# EAGLE design logic_gates_cmos (EAGLE 7.6.0)
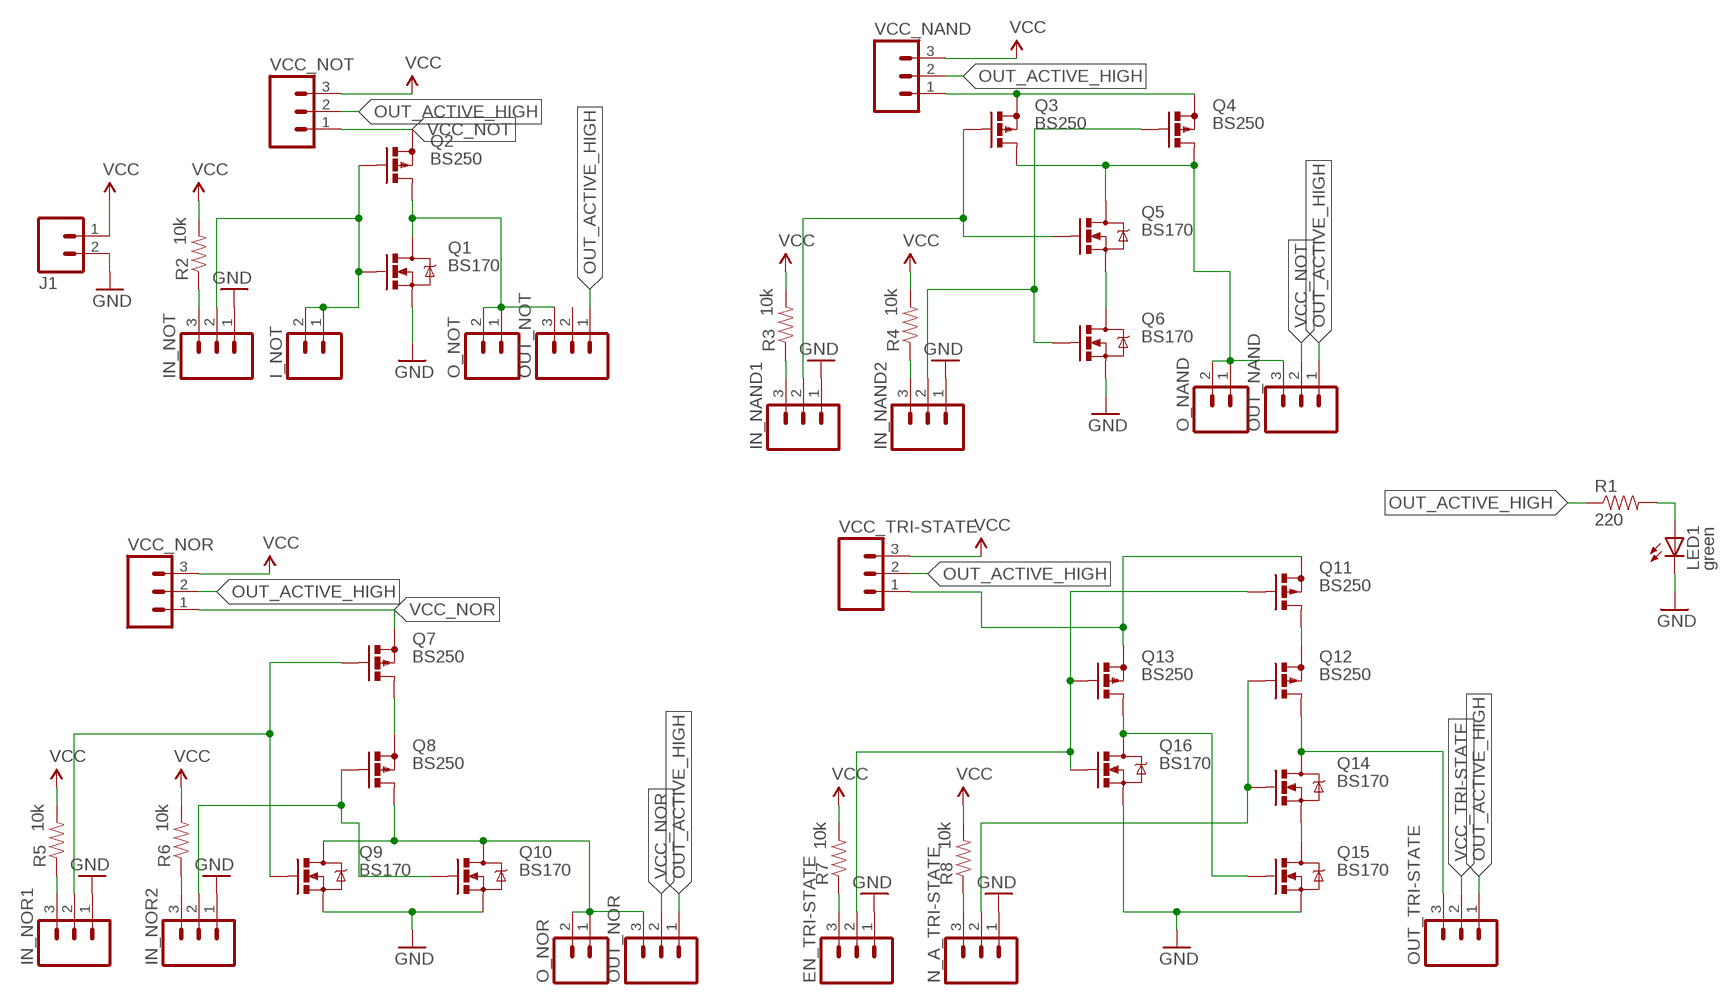
[diagram p0: schematic, sheet 1]

## Parts
EN_TRI-STATE  M03LONGPADS  [1X03_LONGPADS]
I_NOT  M02PTH  [1X02]
IN_NAND1  M03LONGPADS  [1X03_LONGPADS]
IN_NAND2  M03LONGPADS  [1X03_LONGPADS]
IN_NOR1  M03LONGPADS  [1X03_LONGPADS]
IN_NOR2  M03LONGPADS  [1X03_LONGPADS]
IN_NOT  M03LONGPADS  [1X03_LONGPADS]
J1  M02LOCK_LONGPADS  [1X02_LOCK_LONGPADS]
LED1  green  LED3MM  [LED3MM]
N_A_TRI-STATE  M03LONGPADS  [1X03_LONGPADS]
O_NAND  M02PTH  [1X02]
O_NOR  M02PTH  [1X02]
O_NOT  M02PTH  [1X02]
OUT_NAND  M03LONGPADS  [1X03_LONGPADS]
OUT_NOR  M03LONGPADS  [1X03_LONGPADS]
OUT_NOT  M03LONGPADS  [1X03_LONGPADS]
OUT_TRI-STATE  M03LONGPADS  [1X03_LONGPADS]
Q1  BS170  BS170_LP  [TO92-OVAL]
Q2  BS250  PFETBS250  [TO92-OVAL]
Q3  BS250  PFETBS250  [TO92-OVAL]
Q4  BS250  PFETBS250  [TO92-OVAL]
Q5  BS170  BS170_LP  [TO92-OVAL]
Q6  BS170  BS170_LP  [TO92-OVAL]
Q7  BS250  PFETBS250  [TO92-OVAL]
Q8  BS250  PFETBS250  [TO92-OVAL]
Q9  BS170  BS170_LP  [TO92-OVAL]
Q10  BS170  BS170_LP  [TO92-OVAL]
Q11  BS250  PFETBS250  [TO92-OVAL]
Q12  BS250  PFETBS250  [TO92-OVAL]
Q13  BS250  PFETBS250  [TO92-OVAL]
Q14  BS170  BS170_LP  [TO92-OVAL]
Q15  BS170  BS170_LP  [TO92-OVAL]
Q16  BS170  BS170_LP  [TO92-OVAL]
R1  220  RESISTORPTH-1/4W  [AXIAL-0.4]
R2  10k  RESISTORPTH-1/4W  [AXIAL-0.4]
R3  10k  RESISTORPTH-1/4W  [AXIAL-0.4]
R4  10k  RESISTORPTH-1/4W  [AXIAL-0.4]
R5  10k  RESISTORPTH-1/4W  [AXIAL-0.4]
R6  10k  RESISTORPTH-1/4W  [AXIAL-0.4]
R7  10k  RESISTORPTH-1/4W  [AXIAL-0.4]
R8  10k  RESISTORPTH-1/4W  [AXIAL-0.4]
VCC_NAND  M03LONGPADS  [1X03_LONGPADS]
VCC_NOR  M03LONGPADS  [1X03_LONGPADS]
VCC_NOT  M03LONGPADS  [1X03_LONGPADS]
VCC_TRI-STATE  M03LONGPADS  [1X03_LONGPADS]

## Nets
GND [pwr_gnd]: EN_TRI-STATE.1 IN_NAND1.1 IN_NAND2.1 IN_NOR1.1 IN_NOR2.1 IN_NOT.1 J1.2 LED1.K(C) N_A_TRI-STATE.1 Q1.3(S) Q6.3(S) Q9.3(S) Q10.3(S) Q15.3(S) Q16.3(S)
N$1: O_NAND.1 O_NAND.2 OUT_NAND.3 Q3.1(D) Q4.1(D) Q5.1(D)
N$2: IN_NOR1.2 Q7.2(G) Q9.2(G)
N$3: Q3.3(S) Q4.3(S) VCC_NAND.1
N$4: IN_NOR1.3 R5.P$1
N$5: Q5.3(S) Q6.1(D)
N$6: IN_NOR2.2 Q8.2(G) Q10.2(G)
N$7: IN_NOR2.3 R6.P$1
N$8: O_NOT.1 O_NOT.2 OUT_NOT.3 Q1.1(D) Q2.1(D)
N$9: O_NOR.1 O_NOR.2 OUT_NOR.3 Q8.1(D) Q9.1(D) Q10.1(D)
N$10: Q7.1(D) Q8.3(S)
N$11: EN_TRI-STATE.2 Q11.2(G) Q13.2(G) Q16.2(G)
N$12: EN_TRI-STATE.3 R7.P$1
N$13: LED1.A R1.P$2
N$14: I_NOT.1 I_NOT.2 IN_NOT.2 Q1.2(G) Q2.2(G)
N$15: IN_NAND2.2 Q4.2(G) Q6.2(G)
N$16: Q13.1(D) Q15.2(G) Q16.1(D)
N$19: Q11.1(D) Q12.3(S)
N$20: Q14.3(S) Q15.1(D)
N$21: IN_NOT.3 R2.P$1
N$22: IN_NAND1.2 Q3.2(G) Q5.2(G)
N$23: N_A_TRI-STATE.2 Q12.2(G) Q14.2(G)
N$24: IN_NAND1.3 R3.P$1
N$26: IN_NAND2.3 R4.P$1
N$27: N_A_TRI-STATE.3 R8.P$1
N$28: OUT_TRI-STATE.3 Q12.1(D) Q14.1(D)
OUT_ACTIVE_HIGH: OUT_NAND.1 OUT_NOR.1 OUT_NOT.1 OUT_TRI-STATE.1 R1.P$1 VCC_NAND.2 VCC_NOR.2 VCC_NOT.2 VCC_TRI-STATE.2
VCC: J1.1 R2.P$2 R3.P$2 R4.P$2 R5.P$2 R6.P$2 R7.P$2 R8.P$2 VCC_NAND.3 VCC_NOR.3 VCC_NOT.3 VCC_TRI-STATE.3
VCC_NOR: OUT_NOR.2 Q7.3(S) VCC_NOR.1
VCC_NOT: OUT_NAND.2 Q2.3(S) VCC_NOT.1
VCC_TRI-STATE: OUT_TRI-STATE.2 Q11.3(S) Q13.3(S) VCC_TRI-STATE.1
Unconnected: OUT_NOT.2

## Library data of the parts
EN_TRI-STATE IN_NAND1 IN_NAND2 IN_NOR1 IN_NOR2 IN_NOT N_A_TRI-STATE OUT_NAND OUT_NOR OUT_NOT OUT_TRI-STATE VCC_NAND VCC_NOR VCC_NOT VCC_TRI-STATE = SparkFun-Connectors:M03: Header 3 Standard 3-pin 0.1" header. Use with straight break away headers (SKU : PRT-00116), right angle break away headers (PRT-00553), swiss pins (PRT-00743), machine pins (PRT-00117), and female headers (PRT-00115). Molex polarized connector foot print use with SKU : PRT-08232 with associated crimp pins and housings.
I_NOT J1 O_NAND O_NOR O_NOT = SparkFun-Connectors:M02: Standard 2-pin 0.1" header. Use with - straight break away headers ( PRT-00116) - right angle break away headers (PRT-00553) - swiss pins (PRT-00743) - machine pins (PRT-00117) - female headers (PRT-00115) Molex polarized connector foot print use with: PRT-08233 with associated crimp pins and housings. 2.54_SCREWTERM for use with PRT-10571. 3.5mm Screw Terminal footprints for PRT-08084 5mm Screw Terminal footprints for use with PRT-08432
LED1 = adafruit:LED: LED OSRAM: - CHIPLED LG R971, LG N971, LY N971, LG Q971, LY Q971, LO R971, LY R971 LH N974, LH R974 LS Q976, LO Q976, LY Q976 LO Q996 - Hyper CHIPLED LW Q18S LB Q993, LB Q99A, LB R99A - SideLED LS A670, LO A670, LY A670, LG A670, LP A670 LB A673, LV A673, LT A673, LW A673 LH A674 LY A675 LS A676, LA A676, LO A676, LY A676, LW A676 LS A679, LY A679, LG A679 - Hyper Micro SIDELED® LS Y876, LA Y876, LO Y876, LY Y876 LT Y87S - SmartLED LW L88C, LW L88S LB L89C, LB L89S, LG L890 LS L89K, LO L89K, LY L89K LS L896, LA L896, LO L896, LY L896 - TOPLED LS T670, LO T670, LY T670, LG T670, LP T670 LSG T670, LSP T670, LSY T670, LOP T670, LYG T670 LG T671, LOG T671, LSG T671 LB T673, LV T673, LT T673, LW T673 LH T674 LS T676, LA T676, LO T676, LY T676, LB T676, LH T676, LSB T676, LW T676 LB T67C, LV T67C, LT T67C, LS T67K, LO T67K, LY T67K, LW E67C LS E67B, LA E67B, LO E67B, LY E67B, LB E67C, LV E67C, LT E67C LW T67C LS T679, LY T679, LG T679 LS T770, LO T770, LY T770, LG T770, LP T770 LB T773, LV T773, LT T773, LW T773 LH T774 LS E675, LA E675, LY E675, LS T675 LS T776, LA T776, LO T776, LY T776, LB T776 LHGB T686 LT T68C, LB T68C - Hyper Mini TOPLED® LB M676 - Mini TOPLED Santana® LG M470 LS M47K, LO M47K, LY M47K Source: http://www.osram.convergy.de/
Q1 Q5 Q6 Q9 Q10 Q14-Q16 = Useful_Parts:BS170_LP
Q2-Q4 Q7 Q8 Q11-Q13 = Useful_Parts:PFET: P-CHANNEL MOS FET
R1-R8 = SparkFun-Resistors:RESISTOR: Resistor Basic schematic elements and footprints for 0603, 1206, and PTH resistors.

## Net classes
0 default: width 0.5 mm, drill 0.8 mm, clearance 0.4 mm
1 pwr_gnd: width 0.4 mm, drill 0.8 mm, clearance 0.5 mm

## Board
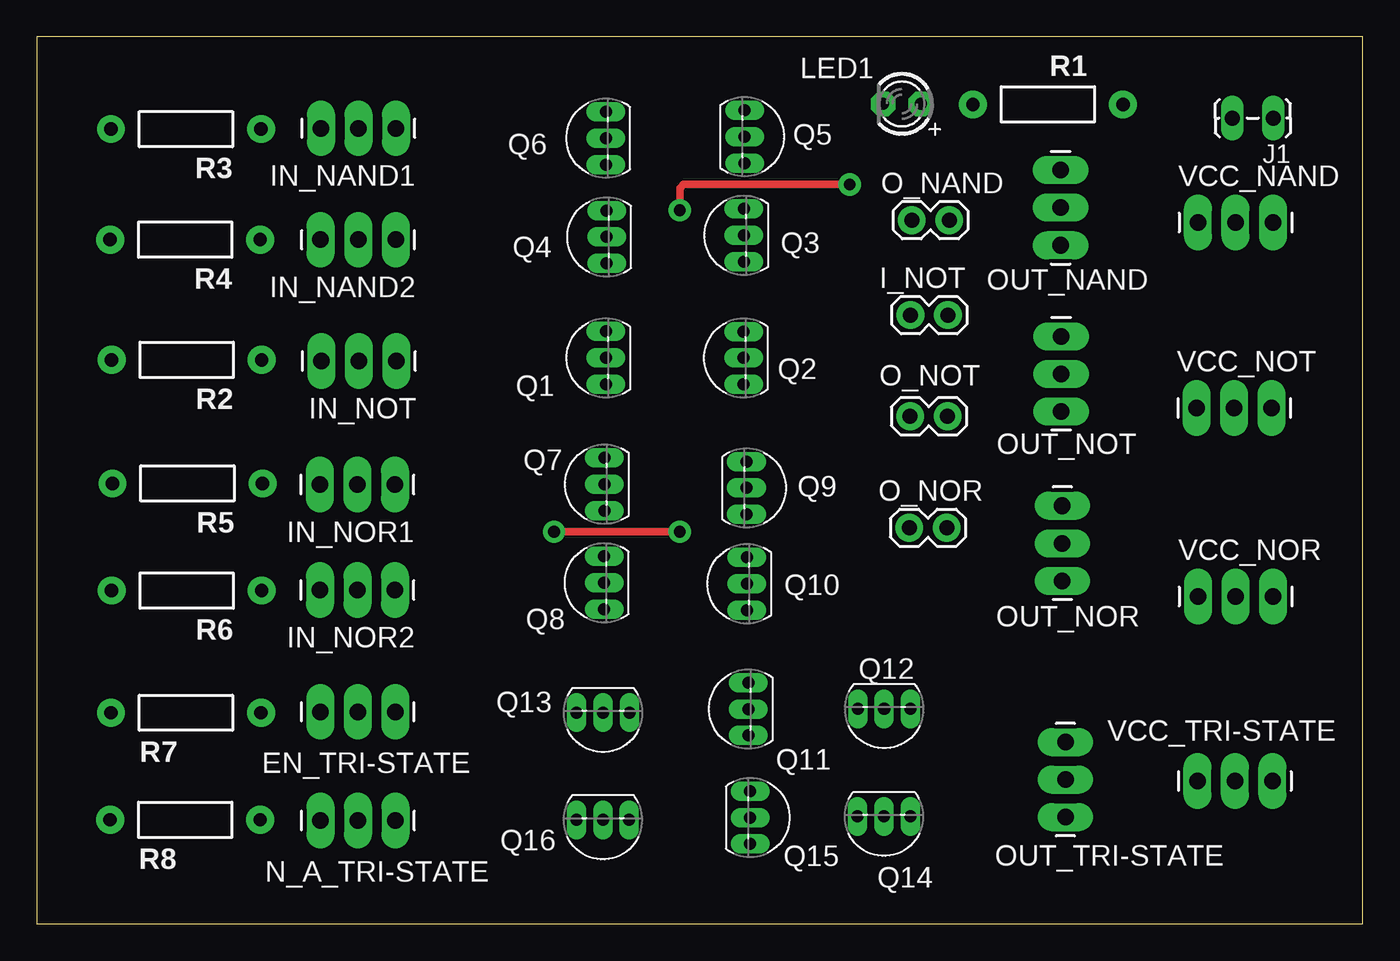
[diagram p1: board, top side]
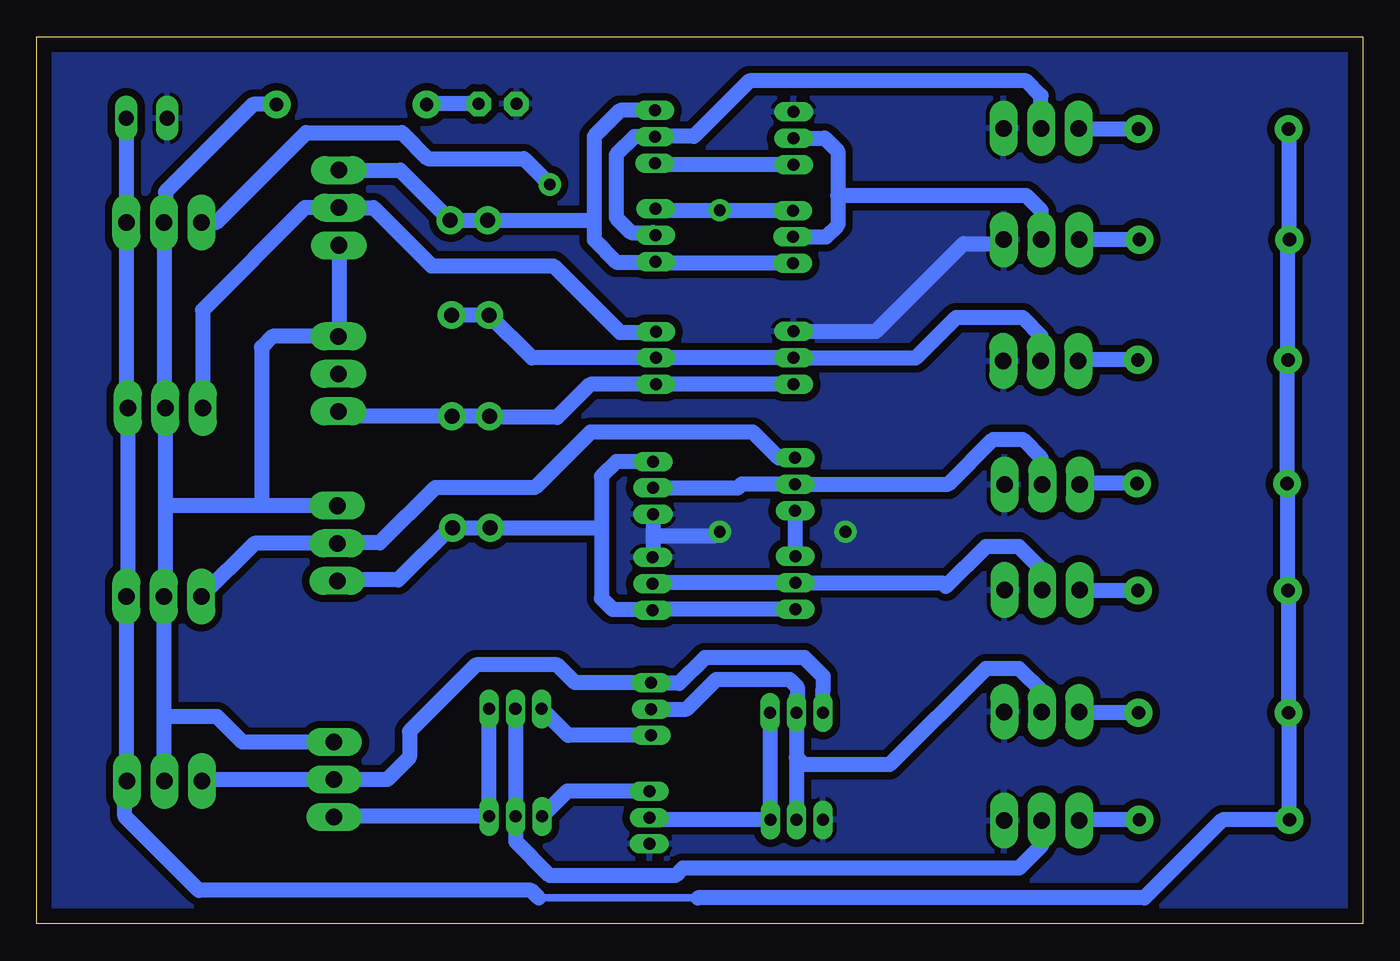
[diagram p2: board, bottom side, seen from below]

Size 89.7 x 59.98 mm. Coordinates in mm from the lower left corner, seen from the top.
Outline: 0,0 89.7,0 89.7,59.98 0,59.98 0,0
Copper layers (1*16): Top 0.035mm / dielectric 1.5mm / Bottom 0.035mm
Design rules "default": minimum track width 10mil, minimum drill 24mil, track to track 8mil, track to pad 8mil, pad to pad 8mil, via to via 8mil, smd to smd 8mil, copper to edge 40mil, drill to drill 8mil, minimum pad ring 10mil, minimum via ring 8mil, stop-mask expansion 4mil, vias tented up to drill 0mil, thermal gap 10mil

### Footprints (pad centres in the part's own frame; a part is rotated, then mirrored left to right if it is on the bottom)
1X03_LONGPADS = drill 1.118 pad 1.88 long: 1 0,0; 2 2.54,0; 3 5.08,0
1X02 = drill 1.016 pad 1.88: 1 0,0; 2 2.54,0
1X02_LOCK_LONGPADS = drill 1.016 long: 1 -0.127,0; 2 2.667,0
LED3MM = drill 0.813 pad 1.676 octagon: A -1.27,0; K 1.27,0
TO92-OVAL = drill 0.813 long: 1 -1.786,0; 2 0,0; 3 1.786,0
AXIAL-0.4 = drill 0.9 pad 1.88: P$1 -5.08,0; P$2 5.08,0

### Placement (x,y rotation side)
EN_TRI-STATE  24.25,14.33 180 top
I_NOT  59.1,41.17 0 top
IN_NAND1  24.29,53.8 180 top
IN_NAND2  24.28,46.26 180 top
IN_NOR1  24.22,29.7 180 top
IN_NOR2  24.23,22.57 180 top
IN_NOT  24.32,38.06 180 top
J1  83.54,54.49 180 top
LED1  58.53,55.45 180 top
N_A_TRI-STATE  24.26,6.97 180 top
O_NAND  59.19,47.58 0 top
O_NOR  59.02,26.77 0 top
O_NOT  59.08,34.32 0 top
OUT_NAND  69.26,45.89 90 top
OUT_NOR  69.39,28.27 270 top
OUT_NOT  69.3,39.73 270 top
OUT_TRI-STATE  69.59,12.28 270 top
Q1  38.5,38.27 90 top
Q2  47.81,38.26 90 top
Q3  47.84,46.56 90 top
Q4  38.55,46.45 90 top
Q5  47.88,53.23 270 top
Q6  38.49,53.13 90 top
Q7  38.4,29.72 90 top
Q8  38.39,23.06 90 top
Q9  48.01,29.47 270 top
Q10  48.04,22.99 90 top
Q11  48.14,14.52 90 top
Q12  57.33,14.53 180 top
Q13  38.31,14.27 180 top
Q14  57.31,7.25 180 top
Q15  48.26,7.18 270 top
Q16  38.29,7.02 180 top
R1  68.41,55.42 180 top
R2  10.13,38.14 180 top
R3  10.08,53.75 180 top
R4  10.03,46.27 180 top
R5  10.18,29.78 180 top
R6  10.13,22.53 180 top
R7  10.08,14.27 180 top
R8  10.03,7.02 180 top
VCC_NAND  78.57,47.43 0 top
VCC_NOR  78.57,22.13 0 top
VCC_NOT  78.47,34.89 0 top
VCC_TRI-STATE  78.52,9.66 0 top

### Tracks (layer width: path | path; a pad name or v marks a point on that pad's centre or on a via)
GND  (via drill 0.8 pad 1.5)
  Top 0.5: v43.5,26.5 v35,26.5
  Bottom 1: Q10.3 48.01,24.8 Q9.3 48.01,26.26 48,26.25 43.75,26.25 v43.5,26.5 | Q1.3 32.94,40.06 27,46 24.54,46 IN_NAND2.1
  pour Bottom: 0,0 0,60.25 90,60.25 90,60 90,-0.25 0,-0.25
N$1
  Bottom 1: Q4.1 47.73,44.66 Q3.1 47.87,44.75 50.5,44.75 52,46.25 52,47.75 | Q5.1 50.23,55.02 52,53.25 52,47.75 | OUT_NAND.3 65.12,50.97 O_NAND.2 O_NAND.1 52.17,47.58 52,47.75
N$2
  Bottom 1: IN_NOR1.2 21.75,29.77 21.75,31.5 23,32.75 25,32.75 28.03,29.72 Q7.2 38.43,29.75 42,29.75 42.28,29.47 Q9.2
N$3  (via drill 0.8 pad 1.5)
  Top 0.5: v55,50 43.75,50 43.5,49.75 v43.5,48.25
  Bottom 0.5: 47.73,48.24 43.51,48.24 v43.5,48.25
  Bottom 1: Q4.3 47.73,48.24 Q3.3 | VCC_NAND.1 77.57,47.43 71.5,53.5 65,53.5 63.25,51.75 56.75,51.75 v55,50
N$4
  Bottom 1: R5.P$1 19.06,29.78 IN_NOR1.3
N$5
  Bottom 1: Q6.1 47.78,51.35 Q5.3
N$6
  Bottom 1: Q10.2 48.72,23.06 Q8.2 28.44,23.06 28.19,22.81 25.5,25.5 23.25,25.5 21.75,24 21.75,22.63 IN_NOR2.2
N$7
  Bottom 1: R6.P$1 19.11,22.53 IN_NOR2.3
N$8
  Bottom 1: Q1.1 Q2.1 52.27,36.48 54.5,34.25 59.01,34.25 O_NOT.1 O_NOT.2 68.97,34.32 OUT_NOT.3
N$9
  Bottom 1: Q9.1 50.49,31.26 51.5,30.25 51.5,26.75 | 51.5,26.75 51.5,22 50.75,21.25 48.83,21.25 Q10.1 48.72,21.27 Q8.1 | 51.5,26.75 51.52,26.77 O_NOR.1 O_NOR.2 61.73,26.77 65.25,23.25 69.32,23.25 OUT_NOR.3
N$10
  Bottom 1: Q7.1 38.4,24.86 Q8.3
N$11
  Bottom 1: EN_TRI-STATE.2 21.71,15.71 23.25,17.25 25.5,17.25 32,10.75 37.81,10.75 38.31,11.25 | 38.31,11.25 Q13.2 38.31,15 | 38.31,11.25 38.31,7.03 Q16.2 | 38.31,15 38.31,15.31 | Q11.2 45.73,14.52 43.75,16.5 38.75,16.5 38.25,16 38.25,15.06 38.31,15
N$12
  Bottom 1: R7.P$1 19.11,14.27 EN_TRI-STATE.3
N$13
  Bottom 1: LED1.A 63.3,55.45 R1.P$2
N$14
  Bottom 1: IN_NOT.2 21.75,38.09 21.75,39.75 23,41 27.5,41 30.23,38.27 Q1.2 Q2.2 56.2,38.26 I_NOT.1 I_NOT.2
N$15
  Bottom 1: 35.5,49.25 35.5,52.25 36.38,53.13 Q6.2 | 35.5,49.25 35.5,47.25 36.3,46.45 Q4.2 | IN_NAND2.2 21.73,48.23 22.75,49.25 35.5,49.25
N$16
  Bottom 1: Q13.1 40.09,7.03 Q16.1 48.1,7.02 Q15.2
N$19
  Bottom 1: Q11.1 53.75,12.73 Q12.3
N$20
  Bottom 1: Q15.1 53.81,8.96 Q14.3
N$21
  Bottom 1: R2.P$1 19.16,38.14 IN_NOT.3
N$22
  Bottom 1: Q3.2 48.03,46.75 49.5,46.75 50.5,47.75 50.5,52 49.27,53.23 Q5.2 47.87,53.25 45.25,53.25 41.5,57 22.75,57 21.75,56 IN_NAND1.2
N$23
  Bottom 1: Q12.2 57.33,7.27 Q14.2 57.31,5.56 55,3.25 46.5,3.25 46,3.75 23.25,3.75 21.72,5.28 N_A_TRI-STATE.2
N$24
  Bottom 1: R3.P$1 19.16,53.75 IN_NAND1.3
N$26
  Bottom 1: R4.P$1 19.19,46.27 IN_NAND2.3
N$27
  Bottom 1: R8.P$1 19.13,7.02 N_A_TRI-STATE.3
N$28
  Bottom 1: Q12.1 59.1,14.51 Q14.1 69.54,7.25 OUT_TRI-STATE.3
OUT_ACTIVE_HIGH
  Bottom 1: R1.P$1 75.08,55.42 81,49.5 81,47.53 VCC_NAND.2 81.11,34.98 VCC_NOT.2 81.01,28.5 | 81.01,28.5 81.01,22.23 VCC_NOR.2 81.11,13.75 | 81.11,13.75 81.11,9.71 VCC_TRI-STATE.2 | OUT_NAND.1 69.26,39.77 OUT_NOT.1 73.77,39.73 74.5,39 74.5,28.27 | OUT_NOR.1 74.5,28.27 | 74.5,28.27 80.78,28.27 81.01,28.5 | OUT_TRI-STATE.1 75.78,12.28 77.5,14 80.86,14 81.11,13.75
VCC
  Bottom 0.5: 45,1.75 55.75,1.75
  Bottom 1: R3.P$2 4.95,53.7 R4.P$2 5.05,46.17 R2.P$2 5.1,38.08 R5.P$2 5.05,29.72 R6.P$2 5,22.49 R7.P$2 4.95,14.21 R8.P$2 9.48,7.02 14.75,1.75 45,1.75 | 55.75,1.75 56.25,2.25 78.75,2.25 83.75,7.25 83.75,9.51 VCC_TRI-STATE.3 83.65,9.71 VCC_NOR.3 83.55,22.23 VCC_NOT.3 83.65,34.98 VCC_NAND.3 83.67,47.45 J1.1
VCC_NOR
  Bottom 1: VCC_NOR.1 74.98,25.73 OUT_NOR.2 69.36,25.75 66.5,25.75 62.75,29.5 56,29.5 52.25,33.25 41.25,33.25 39.51,31.51 Q7.3
VCC_NOT
  Bottom 1: VCC_NOT.1 78.5,34.92 78.5,41.5 71.57,48.43 OUT_NAND.2 66.93,48.43 63,44.5 54.75,44.5 50.25,40 47.86,40 Q2.3
VCC_TRI-STATE
  Bottom 1: VCC_TRI-STATE.1 78.44,9.74 OUT_TRI-STATE.2 66,9.75 64.5,11.25 64.5,13 60,17.5 54.5,17.5 53.3,16.3 Q11.3 48.09,16.25 46.25,16.25 44.5,18 37.75,18 36.5,16.75 36.5,15.79 36.52,15.77 Q13.3